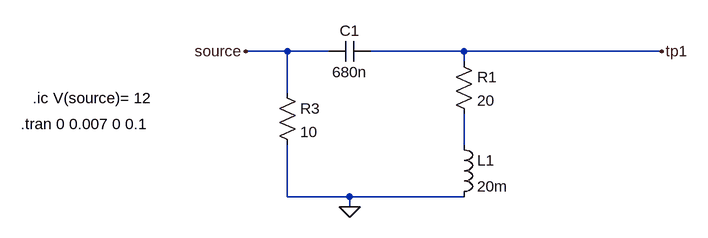
[diagram p0: schematic LTSPICE premiere partie .asc]
LTSPICE premiere partie .asc, the LTspice schematic file:
Version 4
SHEET 1 880 680
WIRE 192 48 128 48
WIRE 256 48 192 48
WIRE 464 48 320 48
WIRE 768 48 464 48
WIRE 464 64 464 48
WIRE 192 112 192 48
WIRE 464 192 464 144
WIRE 192 272 192 192
WIRE 288 272 192 272
WIRE 464 272 288 272
WIRE 288 288 288 272
FLAG 288 288 0
FLAG 128 48 source
FLAG 768 48 tp1
SYMBOL ind 448 176 R0
SYMATTR InstName L1
SYMATTR Value 20m
SYMBOL res 448 48 R0
SYMATTR InstName R1
SYMATTR Value 20
SYMBOL cap 320 32 R90
WINDOW 0 0 32 VBottom 2
WINDOW 3 32 32 VTop 2
SYMATTR InstName C1
SYMATTR Value 680n
SYMBOL res 176 96 R0
SYMATTR InstName R3
SYMATTR Value 10
TEXT -218 160 Left 2 !.tran 0 0.007 0 0.1
TEXT -200 120 Left 2 !.ic V(source)= 12

The netlist it stands for:
* LTSPICE premiere partie .asc
L1 N001 0 20m
R1 tp1 N001 20
C1 tp1 source 680n
R3 source 0 10
.tran 0 0.007 0 0.1
.ic V(source)= 12
.backanno
.end